# EAGLE design attiny_bootloader (EAGLE 6.6.0)
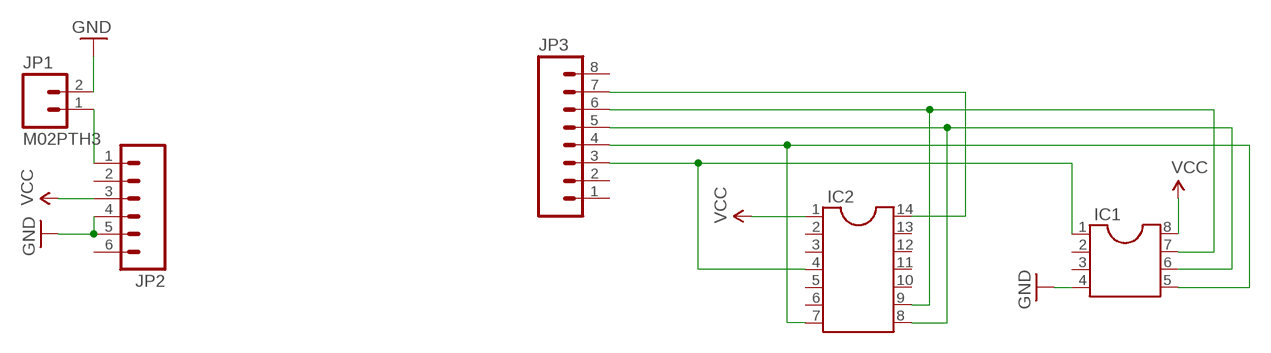
[diagram p0: schematic, sheet 1]

## Parts
IC1  DIL8S  [SOCKET-08]
IC2  DIL14S  [SOCKET-14]
JP1  M02PTH3  [1X02_LONGPADS]
JP2  M06LONGPADS  [1X06_LONGPADS]
JP3  M08LONGPADS  [1X08_LONGPADS]

## Nets
GND: IC1.4 JP1.2 JP2.4 JP2.5
N$1: IC2.14 JP3.7
N$3: IC1.1 IC2.4 JP3.3
N$5: IC1.7 IC2.9 JP3.6
N$6: IC1.6 IC2.8 JP3.5
N$7: IC1.5 IC2.7 JP3.4
N$10: JP1.1 JP2.1
VCC: IC1.8 IC2.1 JP2.3
Unconnected: IC1.2 IC1.3 IC2.2 IC2.3 IC2.5 IC2.6 IC2.10 IC2.11 IC2.12 IC2.13 JP2.2 JP2.6 JP3.1 JP3.2 JP3.8

## Library data of the parts
IC1 = ic-package:DIL8: Dual In Line / Socket
IC2 = ic-package:DIL14: Dual In Line / Socket
JP1 = SparkFun-Connectors:M02: Standard 2-pin 0.1" header. Use with - straight break away headers ( PRT-00116) - right angle break away headers (PRT-00553) - swiss pins (PRT-00743) - machine pins (PRT-00117) - female headers (PRT-00115) Molex polarized connector foot print use with: PRT-08233 with associated crimp pins and housings. 2.54_SCREWTERM for use with PRT-10571. 3.5mm Screw Terminal footprints for PRT-08084 5mm Screw Terminal footprints for use with PRT-08433
JP2 = SparkFun-Connectors:M06: Header 6 Standard 6-pin 0.1" header. Use with straight break away headers (SKU : PRT-00116), right angle break away headers (PRT-00553), swiss pins (PRT-00743), machine pins (PRT-00117), and female headers (PRT-00115). Molex polarized connector foot print use with SKU : PRT-08094 with associated crimp pins and housings. NOTES ON THE VARIANTS LOCK and LOCK_LONGPADS... This footprint was designed to help hold the alignment of a through-hole component (i.e. 6-pin header) while soldering it into place. You may notice that each hole has been shifted either up or down by 0.005 of an inch from it's more standard position (which is a perfectly straight line). This slight alteration caused the pins (the squares in the middle) to touch the edges of the holes. Because they are alternating, it causes a "brace" to hold the component in place. 0.005 has proven to be the perfect amount of "off-center" position when using our standard breakaway headers. Although looks a little odd when you look at the bare footprint, once you have a header in there, the alteration is very hard to notice. Also,if you push a header all the way into place, it is covered up entirely on the bottom side. This idea of altering the position of holes to aid alignment will be further integrated into the Sparkfun Library for other footprints. It can help hold any component with 3 or more connection pins.
JP3 = SparkFun-Connectors:M08: Header 8 Standard 8-pin 0.1" header. Use with straight break away headers (SKU : PRT-00116), right angle break away headers (PRT-00553), swiss pins (PRT-00743), machine pins (PRT-00117), and female headers (PRT-00115).

## Board
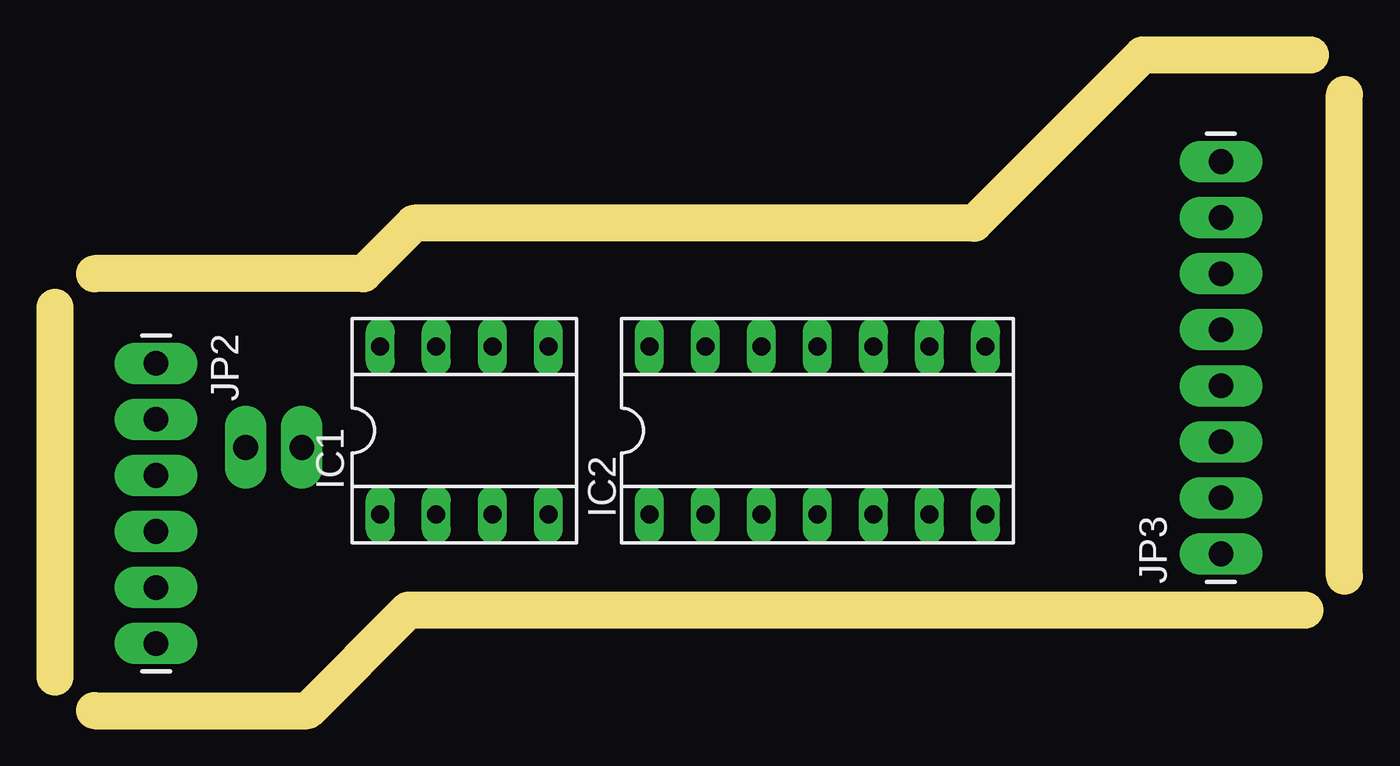
[diagram p1: board, top side]
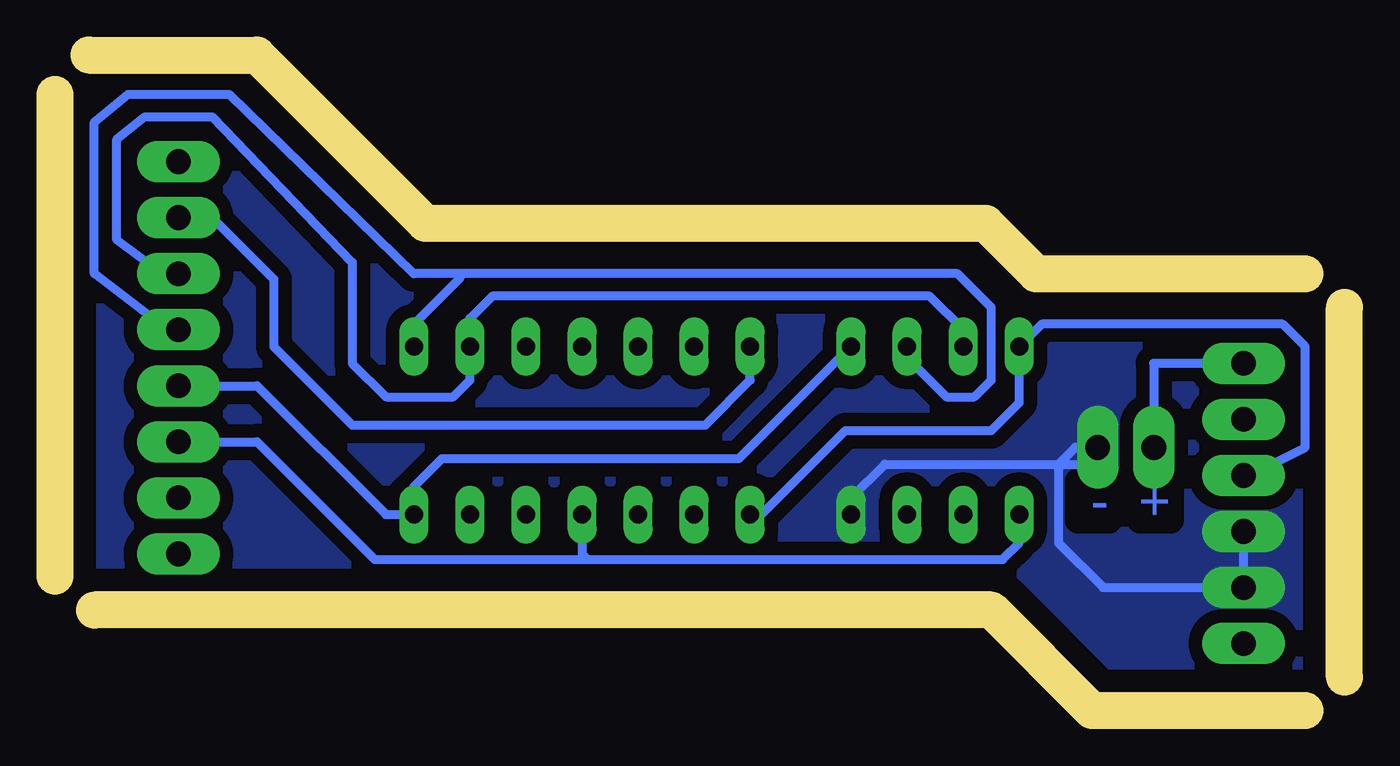
[diagram p2: board, bottom side, seen from below]

Size 58.42 x 29.72 mm. Coordinates in mm from the lower left corner, seen from the top.
Outline: 0,1.52 0,18.29
Outline: 1.78,0 11.43,0 16,4.57 56.64,4.57
Outline: 58.42,6.1 58.42,27.94
Outline: 56.9,29.72 49.28,29.72 41.66,22.1 16.26,22.1 13.97,19.81 1.78,19.81
Copper layers (1*16): Top 0.035mm / dielectric 1.5mm / Bottom 0.035mm
Design rules "default": minimum track width 10mil, minimum drill 24mil, track to track 8mil, track to pad 8mil, pad to pad 8mil, via to via 8mil, smd to smd 8mil, copper to edge 40mil, drill to drill 8mil, minimum pad ring 10mil, minimum via ring 8mil, stop-mask expansion 4mil, vias tented up to drill 0mil, thermal gap 10mil

### Footprints (pad centres in the part's own frame; a part is rotated, then mirrored left to right if it is on the bottom)
SOCKET-08 = drill 0.813 long: 1 -3.81,-3.81; 2 -1.27,-3.81; 3 1.27,-3.81; 4 3.81,-3.81; 5 3.81,3.81; 6 1.27,3.81; 7 -1.27,3.81; 8 -3.81,3.81
SOCKET-14 = drill 0.813 long: 1 -7.62,-3.81; 2 -5.08,-3.81; 3 -2.54,-3.81; 4 0,-3.81; 5 2.54,-3.81; 6 5.08,-3.81; 7 7.62,-3.81; 8 7.62,3.81; 9 5.08,3.81; 10 2.54,3.81; 11 0,3.81; 12 -2.54,3.81; 13 -5.08,3.81; 14 -7.62,3.81
1X02_LONGPADS = drill 1.118 pad 1.88 long: 1 0,0; 2 2.54,0
1X06_LONGPADS = drill 1.118 pad 1.88 long: 1 0,0; 2 2.54,0; 3 5.08,0; 4 7.62,0; 5 10.16,0; 6 12.7,0
1X08_LONGPADS = drill 1.118 pad 1.88 long: 1 0,0; 2 2.54,0; 3 5.08,0; 4 7.62,0; 5 10.16,0; 6 12.7,0; 7 15.24,0; 8 17.78,0

### Placement (x,y rotation side)
IC1  18.54,12.7 0 top
IC2  34.54,12.7 0 top
JP1  8.64,11.94 0 top
JP2  4.57,15.75 270 top
JP3  52.83,7.11 90 top

### Tracks (layer width: path | path; a pad name or v marks a point on that pad's centre or on a via)
GND
  Bottom 0.406: JP2.4 JP2.5 10.92,5.59 12.95,7.62 12.95,11.18 | IC1.4 22.35,9.65 20.83,11.18 12.95,11.18 | 12.95,11.18 11.43,11.18 JP1.2 12.19,11.94 12.95,11.18
  pour Bottom (isolate 0.61, no thermals): 0,0 0,19.81 13.97,19.81 16.26,22.1 41.4,22.1 49.02,29.72 57.66,29.72 58.42,28.96 58.42,6.1 56.9,4.57 16,4.57 11.43,0
N$1
  Bottom 0.406: JP3.7 51.31,22.35 48.51,19.56 48.51,16.51 44.96,12.95 28.96,12.95 26.92,14.99 IC2.14
N$3
  Bottom 0.406: JP3.3 49.28,12.19 43.94,6.86 34.29,6.86 | 34.29,6.86 15.49,6.86 14.73,7.62 IC1.1 | IC2.4 34.54,7.11 34.29,6.86
N$5
  Bottom 0.406: IC1.7 17.27,17.27 18.8,18.8 38.61,18.8 39.62,17.78 IC2.9 39.62,14.99 40.39,14.22 43.43,14.22 44.96,15.75 44.96,20.32 51.31,26.92 54.36,26.92 55.63,25.91 55.63,21.34 53.59,19.81 JP3.6
N$6
  Bottom 0.406: IC1.6 19.81,16 18.03,14.22 16.76,14.22 16,14.99 16,18.29 17.53,19.81 40.07,19.81 | 40.07,19.81 42.17,19.81 50.55,27.94 55.12,27.94 56.64,26.67 56.64,19.81 53.34,17.27 JP3.5 | 40.07,19.81 40.07,19.62 42.16,17.53 IC2.8
N$7
  Bottom 0.406: JP3.4 49.28,14.73 43.43,8.89 IC2.7 42.16,10.16 40.89,11.43 27.43,11.43 IC1.5
N$10
  Bottom 0.406: JP2.1 8.64,15.75 JP1.1
VCC
  Bottom 0.406: JP2.3 4.32,10.67 1.78,11.94 1.78,16.51 2.79,17.53 13.72,17.53 IC1.8 14.73,13.97 16,12.7 22.61,12.7 26.42,8.89 IC2.1

### Text on the board
Bottom: + | -